# EAGLE design v1 (EAGLE 8.7.0)

## Sheet 1 of 2
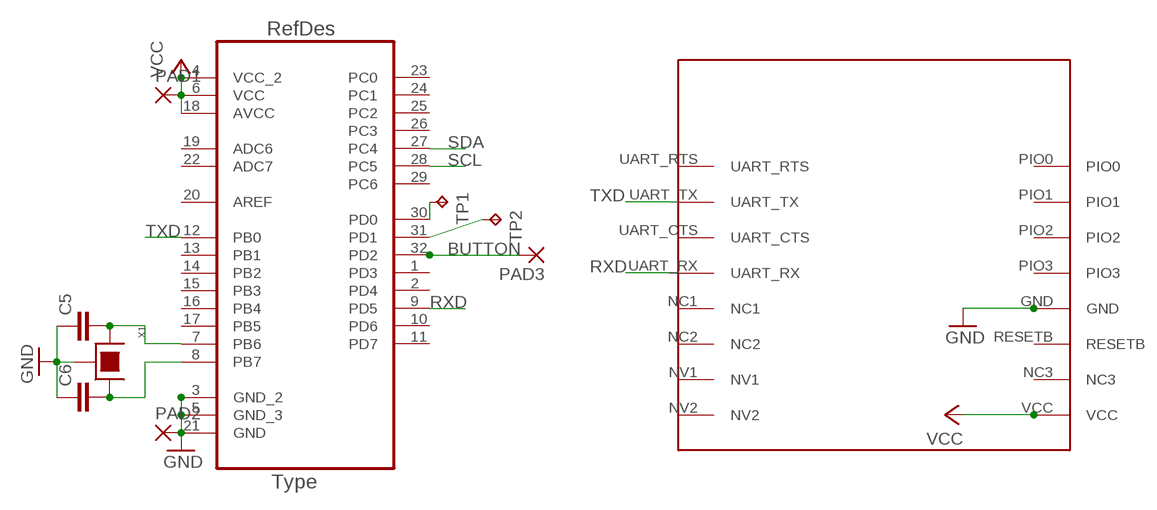
[diagram p0: schematic, sheet 1]

### Parts
C5  C-EUC0402  [C0402]
C6  C-EUC0402  [C0402]
PAD1  SMD2  [SMD1,27-2,54]
PAD2  SMD2  [SMD1,27-2,54]
PAD3  SMD2  [SMD1,27-2,54]
TP1  TPTP14R  [TP14R]
TP2  TPTP14R  [TP14R]
U2  ATMEGA328P-AU  [QFP80P900X900X120-32N]
U$1  HM-11  [HM-11]
X1  SHIELDED_CRYSTAL_TSX-3225  [TSX-3225]

### Nets
BUTTON: PAD3.1(P) U2.32(PD2)
GND: C5.1 C6.1 PAD2.1(P) U2.3(GND_2) U2.5(GND_3) U2.21(GND) U$1.GND X1.2 X1.4 ; also sheet 2
N$1: C5.2 U2.7(PB6) X1.1
N$2: C6.2 U2.8(PB7) X1.3
N$4: TP1.TP U2.30(PD0)
N$6: TP2.TP U2.31(PD1)
RXD: U2.9(PD5) U$1.UART_RX
SCL: U2.28(PC5) ; also sheet 2
SDA: U2.27(PC4) ; also sheet 2
TXD: U2.12(PB0) U$1.UART_TX
VCC: PAD1.1(P) U2.4(VCC_2) U2.6(VCC) U2.18(AVCC) U$1.VCC ; also sheet 2
Unconnected: U2.1(PD3) U2.2(PD4) U2.10(PD6) U2.11(PD7) U2.13(PB1) U2.14(PB2) U2.15(PB3) U2.16(PB4) U2.17(PB5) U2.19(ADC6) U2.20(AREF) U2.22(ADC7) U2.23(PC0) U2.24(PC1) U2.25(PC2) U2.26(PC3) U2.29(PC6) U$1.NC1 U$1.NC2 U$1.NC3 U$1.NV1 U$1.NV2 U$1.PIO0 U$1.PIO1 U$1.PIO2 U$1.PIO3 U$1.RESETB U$1.UART_CTS U$1.UART_RTS

## Sheet 2 of 2
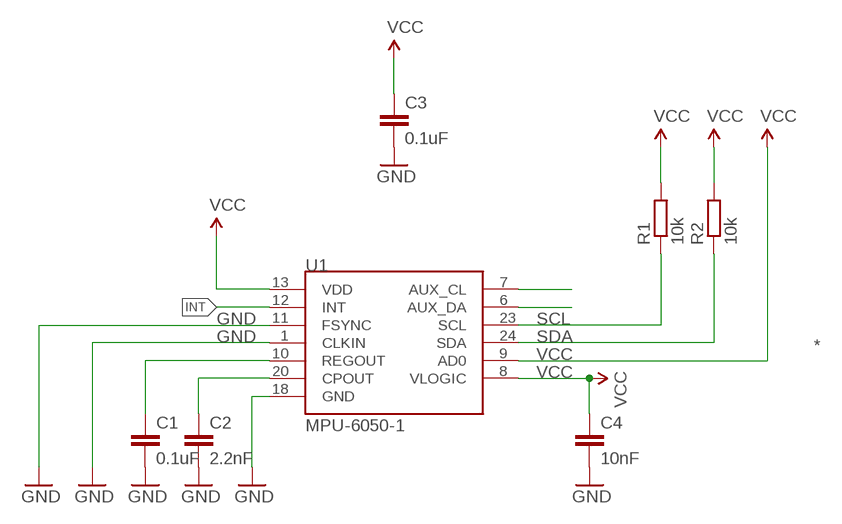
[diagram p1: schematic, sheet 2]

### Parts
C1  0.1uF  C-EUC0402  [C0402]
C2  2.2nF  C-EUC0402  [C0402]
C3  0.1uF  C-EUC0402  [C0402]
C4  10nF  C-EUC0402  [C0402]
R1  10k  R-EU_R0402  [R0402]
R2  10k  R-EU_R0402  [R0402]
U1  MPU-6050-1  [QFN-24-4MM2]

### Nets
AUX_SCL: U1.7(AUX_CL)
AUX_SDA: U1.6(AUX_DA)
GND: C1.2 C2.2 C3.2 C4.2 U1.1(CLKIN) U1.11(FSYNC) U1.18(GND) ; also sheet 1
INT: U1.12(INT)
N$3: C2.1 U1.20(CPOUT)
N$5: C1.1 U1.10(REGOUT)
SCL: R1.1 U1.23(SCL) ; also sheet 1
SDA: R2.1 U1.24(SDA) ; also sheet 1
VCC: C3.1 C4.1 R1.2 R2.2 U1.8(VLOGIC) U1.9(AD0) U1.13(VDD) ; also sheet 1

### Notes on the sheet
- *

## Library data of the parts
C1-C6 = rcl:C-EU: CAPACITOR, European symbol
PAD1-PAD3 = wirepad:SMD2: SMD PAD
R1 R2 = rcl:R-EU_: RESISTOR, European symbol
TP1 TP2 = testpad:TP: Test pad
U1 = Testing:MPU-6050
U2 = Atmel-ATMEGA328P-AU:ATMEGA328P-AU; DESCRIPTION: 8-bit Microcontroller with In-System Programmable Flash; MPN: ATMEGA328P-AU; OC_FARNELL: 1715486; OC_NEWARK: 14R4631; PACKAGE: TQFP-32; SUPPLIER: Atmel
U$1 = HM-11:HM-11
X1 = PP_FreqCtrl:SHIELDED_CRYSTAL

## Net classes
0 Default: width 0.203 mm

## Board
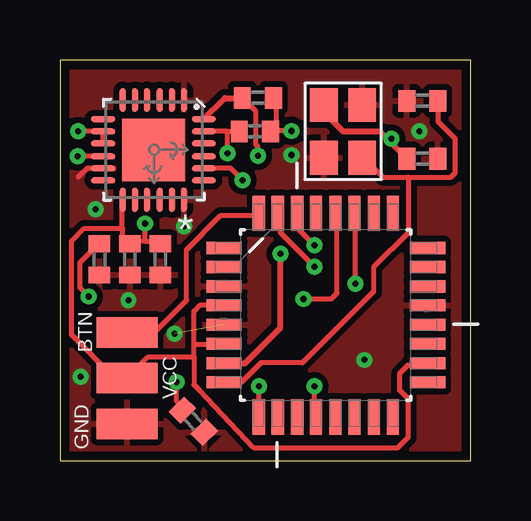
[diagram p2: board, top side]
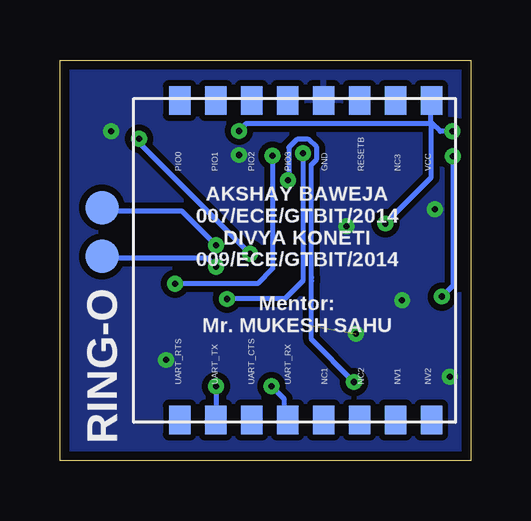
[diagram p3: board, bottom side, seen from below]

Size 17.12 x 16.69 mm. Coordinates in mm from the lower left corner, seen from the top.
Outline: 0,0 17.12,0 17.12,16.69 0,16.69 0,0
Copper layers (1*16): Top 0.035mm / dielectric 1.5mm / Bottom 0.035mm
Design rules "default *": minimum track width 6mil, minimum drill 10mil, track to track 6mil, track to pad 6mil, pad to pad 6mil, via to via 6mil, smd to smd 6mil, copper to edge 15mil, drill to drill 6mil, minimum pad ring 10mil, minimum via ring 8mil, stop-mask expansion 4mil, vias tented up to drill 0.3500125mm, thermal gap 10mil

### Footprints (pad centres in the part's own frame; a part is rotated, then mirrored left to right if it is on the bottom)
C0402 = smd 0.7 x 0.9: 1 -0.65,0; 2 0.65,0
SMD1,27-2,54 = smd 1.27 x 2.54: 1 0,0
R0402 = smd 0.7 x 0.9: 1 -0.65,0; 2 0.65,0
TP14R = smd 1.4 x 1.4: TP 0,0
QFN-24-4MM2 = smd 1.016 x 0.254: 1 -2.066,1.257; 2 -2.066,0.75; 3 -2.066,0.247; 4 -2.066,-0.287; 5 -2.066,-0.792; 6 -2.066,-1.297; 13 2.086,-1.297; 14 2.086,-0.792; 15 2.086,-0.287; 16 2.086,0.247; 17 2.086,0.75; 18 2.086,1.257 | smd 0.254 x 1.016: 7 -1.267,-2.122; 8 -0.762,-2.122; 9 -0.258,-2.122; 10 0.278,-2.122; 11 0.78,-2.122; 12 1.287,-2.122; 19 1.287,2.082; 20 0.78,2.082; 21 0.278,2.082; 22 -0.258,2.082; 23 -0.762,2.082; 24 -1.267,2.082 | smd 2.616 x 2.616: P$1 0.02,-0.01
QFP80P900X900X120-32N = smd 1.473 x 0.508: 1 -4.242,2.794; 2 -4.242,2.007; 3 -4.242,1.194; 4 -4.242,0.406; 5 -4.242,-0.406; 6 -4.242,-1.194; 7 -4.242,-2.007; 8 -4.242,-2.794; 17 4.242,-2.794; 18 4.242,-2.007; 19 4.242,-1.194; 20 4.242,-0.406; 21 4.242,0.406; 22 4.242,1.194; 23 4.242,2.007; 24 4.242,2.794 | smd 0.508 x 1.473: 9 -2.794,-4.242; 10 -2.007,-4.242; 11 -1.194,-4.242; 12 -0.406,-4.242; 13 0.406,-4.242; 14 1.194,-4.242; 15 2.007,-4.242; 16 2.794,-4.242; 25 2.794,4.242; 26 2.007,4.242; 27 1.194,4.242; 28 0.406,4.242; 29 -0.406,4.242; 30 -1.194,4.242; 31 -2.007,4.242; 32 -2.794,4.242
HM-11 = smd 1.2 x 0.9: GND 7.508,-0.6; NC1 -5.808,-0.6; NC2 -5.808,-2.1; NC3 7.508,-3.6; NV1 -5.808,-3.6; NV2 -5.808,-5.1; PIO0 7.508,5.4; PIO1 7.508,3.9; PIO2 7.508,2.4; PIO3 7.508,0.9; RESETB 7.508,-2.1; UART_CTS -5.808,2.4; UART_RTS -5.808,5.4; UART_RX -5.808,0.9; UART_TX -5.808,3.9; VCC 7.508,-5.1
TSX-3225 = smd 1.4 x 1.15: 1 -1.1,-0.8; 2 1.1,-0.8; 3 1.1,0.8; 4 -1.1,0.8

### Placement (x,y rotation side)
C1  1.65,8.38 270 top
C2  5.56,1.64 315 top
C3  4.19,8.38 270 top
C4  2.92,8.38 270 top
C5  15.11,12.57 180 top
C6  15.11,14.99 0 top
PAD1  2.79,3.43 90 top
PAD2  2.79,1.52 90 top
PAD3  2.79,5.33 90 top
R1  8.13,13.72 0 top
R2  8.26,15.11 0 top
TP1  15.37,10.54 0 bottom
TP2  15.37,8.51 0 bottom
U1  3.92,12.95 270 top
U2  11.09,6.06 0 top
U$1  6.73,7.49 90 bottom
X1  11.81,13.72 270 top

### Tracks (layer width: path | path; a pad name or v marks a point on that pad's centre or on a via)
BUTTON
  Top 0.203: U2.32 8.13,10.21 6.71,10.21 5.28,8.79 5.28,6.68 4.01,5.41 2.79,5.41 PAD3.1
GND  (via drill 0.25 pad 0.55)  (1 unrouted)
  Top 0.203: 10.79,12.34 10.97,12.52 X1.2 | U1.11 1.12,12.17 0.76,11.81
  other vias: 0.87,3.49 2.86,6.68 5.18,9.76 14.99,13.72 12.7,4.19 1.49,10.46 9.66,12.73 4.78,5.29
  pour Top (isolate 0.254): 0,16.76 17.14,16.76 17.14,0 0,0
  pour Bottom (isolate 0.254): 0,16.76 17.14,16.76 17.14,0 0,0
N$1  (via drill 0.25)
  Top 0.203: 13.34,13.72 13.64,13.41 | 13.64,13.41 14.35,12.7 C5.2 | 10.97,14.66 X1.1 | 13.64,13.41 v13.82,13.41 | 6.88,4.17 U2.7
  Top 0.254: U2.7 7.71,4.05 9.2,5.53 v9.2,8.61 | X1.1 11.01,14.52 11.81,13.72 13.34,13.72
  Bottom 0.203: v9.2,8.61 13.82,13.23 v13.82,13.41
N$2
  Top 0.203: 14.53,11.81 13.46,11.81 12.75,12.52 X1.3 | 14.53,11.81 16.31,11.81 16.48,11.99 16.48,13.41 15.77,14.12 15.77,14.83 C6.2 | 14.53,11.81 14.53,9.5 13.08,8.05 13.08,7.03 10.11,4.06 8.38,4.06 7.59,3.28 6.88,3.28 U2.8
N$3  (via drill 0.25 pad 0.55)
  Top 0.203: C2.1 4.86,2.48 v4.86,3.27 | v7.62,11.68 7.13,12.17 U1.20
  Bottom 0.203: v7.62,11.68 7.58,11.72 7.58,12.56 7.58,13.04 7.24,13.38 6.75,13.38 6.41,13.04 6.41,12.56 6.64,12.33 6.63,7.63 6.63,7.49 6.63,5.05 v4.86,3.27
N$4  (via drill 0.25)
  Top 0.203: v10.62,8.97 9.91,9.68 9.91,10.21 U2.30
  Bottom 0.203: v10.62,8.97 12.04,10.39 15.24,10.39 TP1.TP
N$5  (via drill 0.25, 0.25 pad 0.55)
  Top 0.203: v1.19,6.83 0.84,7.19 0.84,8.25 1.55,8.97 C1.1 | U1.10 v0.74,12.68
  Bottom 0.203: v0.74,12.68 0.74,7.29 v1.19,6.83
N$6  (via drill 0.25)
  Top 0.203: v10.62,8.08 9.2,9.5 9.2,10.21 U2.31
  Bottom 0.203: v10.62,8.08 10.97,8.43 15.24,8.43 TP2.TP
RXD  (via drill 0.25)
  Top 0.203: v8.31,3.1 8.31,1.85 U2.9
  Bottom 0.203: v8.31,3.1 7.77,2.56 7.77,1.85 U$1.UART_RX
SCL  (via drill 0.25 pad 0.55)
  Top 0.203: U1.23 | v10.16,6.73 11.32,6.73 11.56,6.97 11.56,10.24 U2.28 | 6.98,13.72 U1.23 | 6.98,13.72 R1.1 | R1.1 | v7,12.8 6.98,12.81 6.98,13.72
  Bottom 0.203: v7,12.8 6.99,7.49 7.75,6.73 v10.16,6.73
SDA  (via drill 0.25 pad 0.55)
  Top 0.203: 7.59,15.01 7.6,15.1 R2.1 8.17,14.54 8.17,13.16 8.26,13.08 v8.26,12.7 | v12.32,7.37 12.32,10.26 U2.27
  Top 0.254: U1.24 6.88,15.1 7.6,15.1
  Bottom 0.203: v8.26,12.7 8.26,8 8.88,7.37 v12.31,7.37 v12.32,7.37
TXD  (via drill 0.25)
  Top 0.203: v10.62,3.1 10.62,1.85 U2.12
  Bottom 0.203: v10.62,3.1 10.62,1.85 U$1.UART_TX
VCC  (via drill 0.25 pad 0.55)
  Top 0.203: 3.56,9.14 4.04,9.14 C3.1 | 3.56,9.14 2.97,9.14 C4.1 2.79,9.14 2.62,9.32 2.62,9.68 2.6,9.68 | 2.6,9.68 2.6,10.44 U1.13 | 2.6,9.68 1.02,9.68 0.48,9.14 0.48,5.23 2.26,3.45 2.79,3.45 PAD1.1 3.68,4.32 5.59,4.32 | U2.18 15.24,3.99 14.53,3.99 14.17,3.63 14.17,2.92 14.53,2.56 14.53,0.96 14.1,0.53 8.08,0.53 5.82,2.92 5.59,3.15 5.59,4.32 | 6.71,4.7 U2.6 | R2.2 9.02,15.01 9.02,13.77 R1.2 8.92,13.73 v9.66,13.73 | U1.9 U1.8 v0.76,13.72 | v0.76,13.72 | 3.56,9.14 v3.56,9.88 | U2.4 5.83,6.46 5.59,6.22 5.59,4.83 | U2.6 6.68,4.7 | U2.6 6.8,4.83 5.59,4.83 | 5.59,4.32 5.59,4.83
  Bottom 0.203: 1.73,15.01 U$1.VCC 1.65,14.98 1.65,14.1 | v0.76,13.72 1.27,13.72 1.59,14.03 | 1.59,14.03 1.65,14.1 | 1.65,14.1 1.65,11.78 v3.56,9.88 | 1.59,14.03 9.36,14.03 v9.66,13.73

### Text on the board
tNames: BTN | VCC | GND
bNames: AKSHAY BAWEJA / 007/ECE/GTBIT/2014 / DIVYA KONETI / 009/ECE/GTBIT/2014 / / Mentor: / Mr. MUKESH SAHU | RING-O